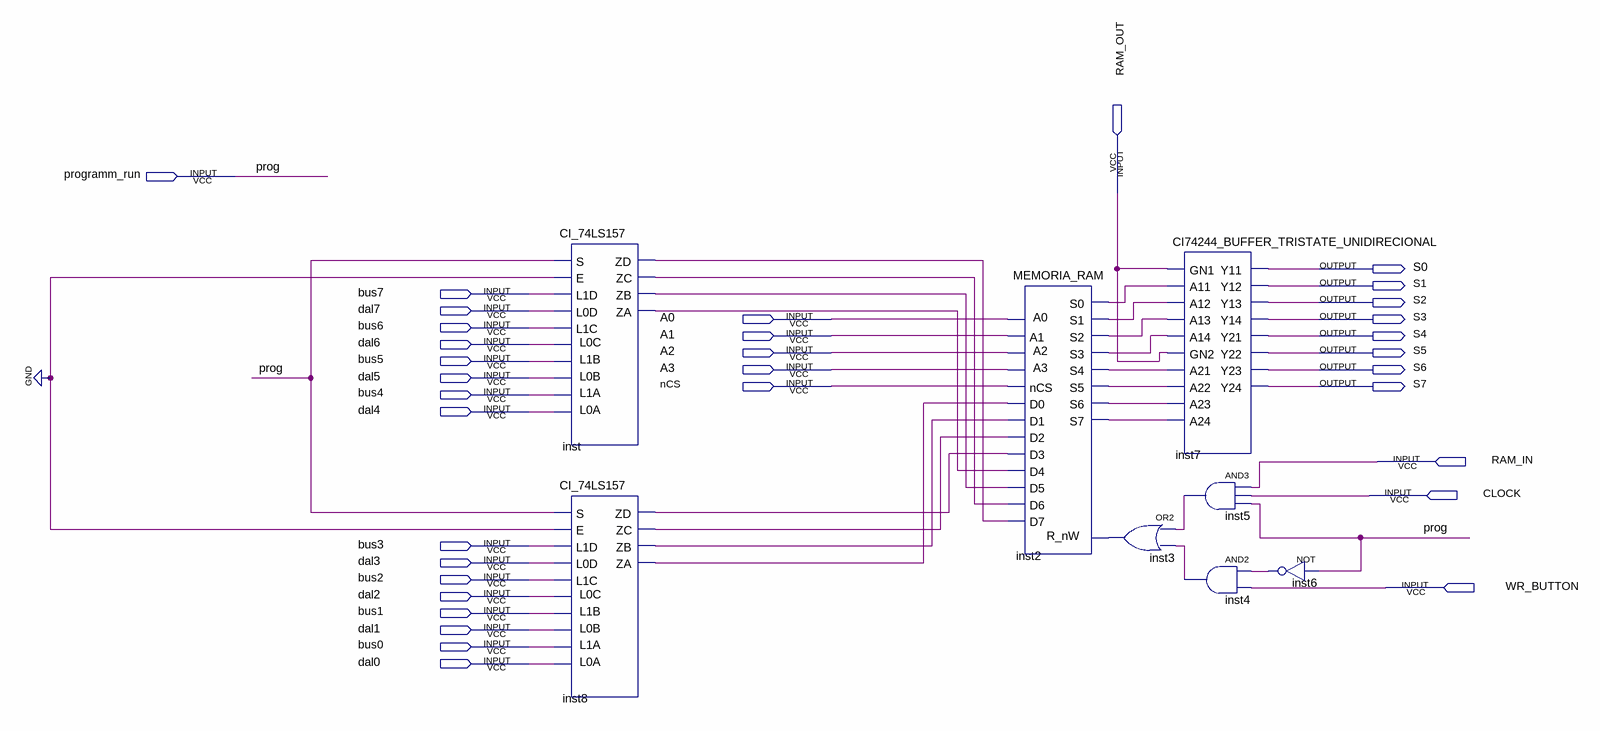
[diagram p0: schematic sheet]
// Quartus schematic MEMORIA_RAM_COMPLETA.bdf as structural Verilog: 8 symbols, 34 pins
module MEMORIA_RAM_COMPLETA (
  input  programm_run,
  input  RAM_OUT,
  input  bus7,
  input  dal7,
  input  A0,
  input  bus6,
  input  A1,
  input  dal6,
  input  A2,
  input  bus5,
  input  A3,
  input  dal5,
  input  nCS,
  input  bus4,
  input  dal4,
  input  RAM_IN,
  input  CLOCK,
  input  bus3,
  input  dal3,
  input  bus2,
  input  WR_BUTTON,
  input  dal2,
  input  bus1,
  input  dal1,
  input  bus0,
  input  dal0,
  output S0,
  output S1,
  output S2,
  output S3,
  output S4,
  output S5,
  output S6,
  output S7
);

  wire inst2_s0, inst2_s1, inst2_s2, inst2_s3, inst2_s4, inst2_s5, inst2_s6, inst2_s7, inst3_out, inst4_out,
       inst5_out, inst6_out, inst8_za, inst8_zb, inst8_zc, inst8_zd, inst_za, inst_zb, inst_zc, inst_zd;

  CI_74LS157 inst (
    .S(programm_run), .E(1'b0), .L1D(bus7), .L0D(dal7), .L0C(dal6), .L1B(bus5), .L0B(dal5), .L1A(bus4),
    .L0A(dal4), .L1C(bus6), .ZD(inst_zd), .ZC(inst_zc), .ZB(inst_zb), .ZA(inst_za));
  CI_74LS157 inst8 (
    .S(programm_run), .E(1'b0), .L1D(bus3), .L0D(dal3), .L0C(dal2), .L1B(bus1), .L0B(dal1), .L1A(bus0),
    .L0A(dal0), .L1C(bus2), .ZD(inst8_zd), .ZC(inst8_zc), .ZB(inst8_zb), .ZA(inst8_za));
  MEMORIA_RAM inst2 (
    .R_nW(inst3_out), .A3(A3), .A2(A2), .A1(A1), .A0(A0), .nCS(nCS), .D0(inst8_za), .D1(inst8_zb),
    .D2(inst8_zc), .D3(inst8_zd), .D4(inst_za), .D5(inst_zb), .D6(inst_zc), .D7(inst_zd), .S0(inst2_s0),
    .S1(inst2_s1), .S2(inst2_s2), .S3(inst2_s3), .S4(inst2_s4), .S5(inst2_s5), .S6(inst2_s6), .S7(inst2_s7));
  or inst3 (inst3_out, inst5_out, inst4_out);
  CI74244_BUFFER_TRISTATE_UNIDIRECIONAL inst7 (
    .GN1(RAM_OUT), .A11(inst2_s0), .A12(inst2_s1), .A13(inst2_s2), .A14(inst2_s3), .GN2(RAM_OUT),
    .A21(inst2_s4), .A22(inst2_s5), .A23(inst2_s6), .A24(inst2_s7), .Y11(S0), .Y12(S1), .Y13(S2), .Y14(S3),
    .Y21(S4), .Y22(S5), .Y23(S6), .Y24(S7));
  and inst5 (inst5_out, RAM_IN, CLOCK, programm_run);
  and inst4 (inst4_out, inst6_out, WR_BUTTON);
  not inst6 (inst6_out, programm_run);

  // Other names for the same wires on the sheet: prog = programm_run
endmodule
